# EAGLE design GFB_MCU_Testboard (EAGLE 9.6.2)
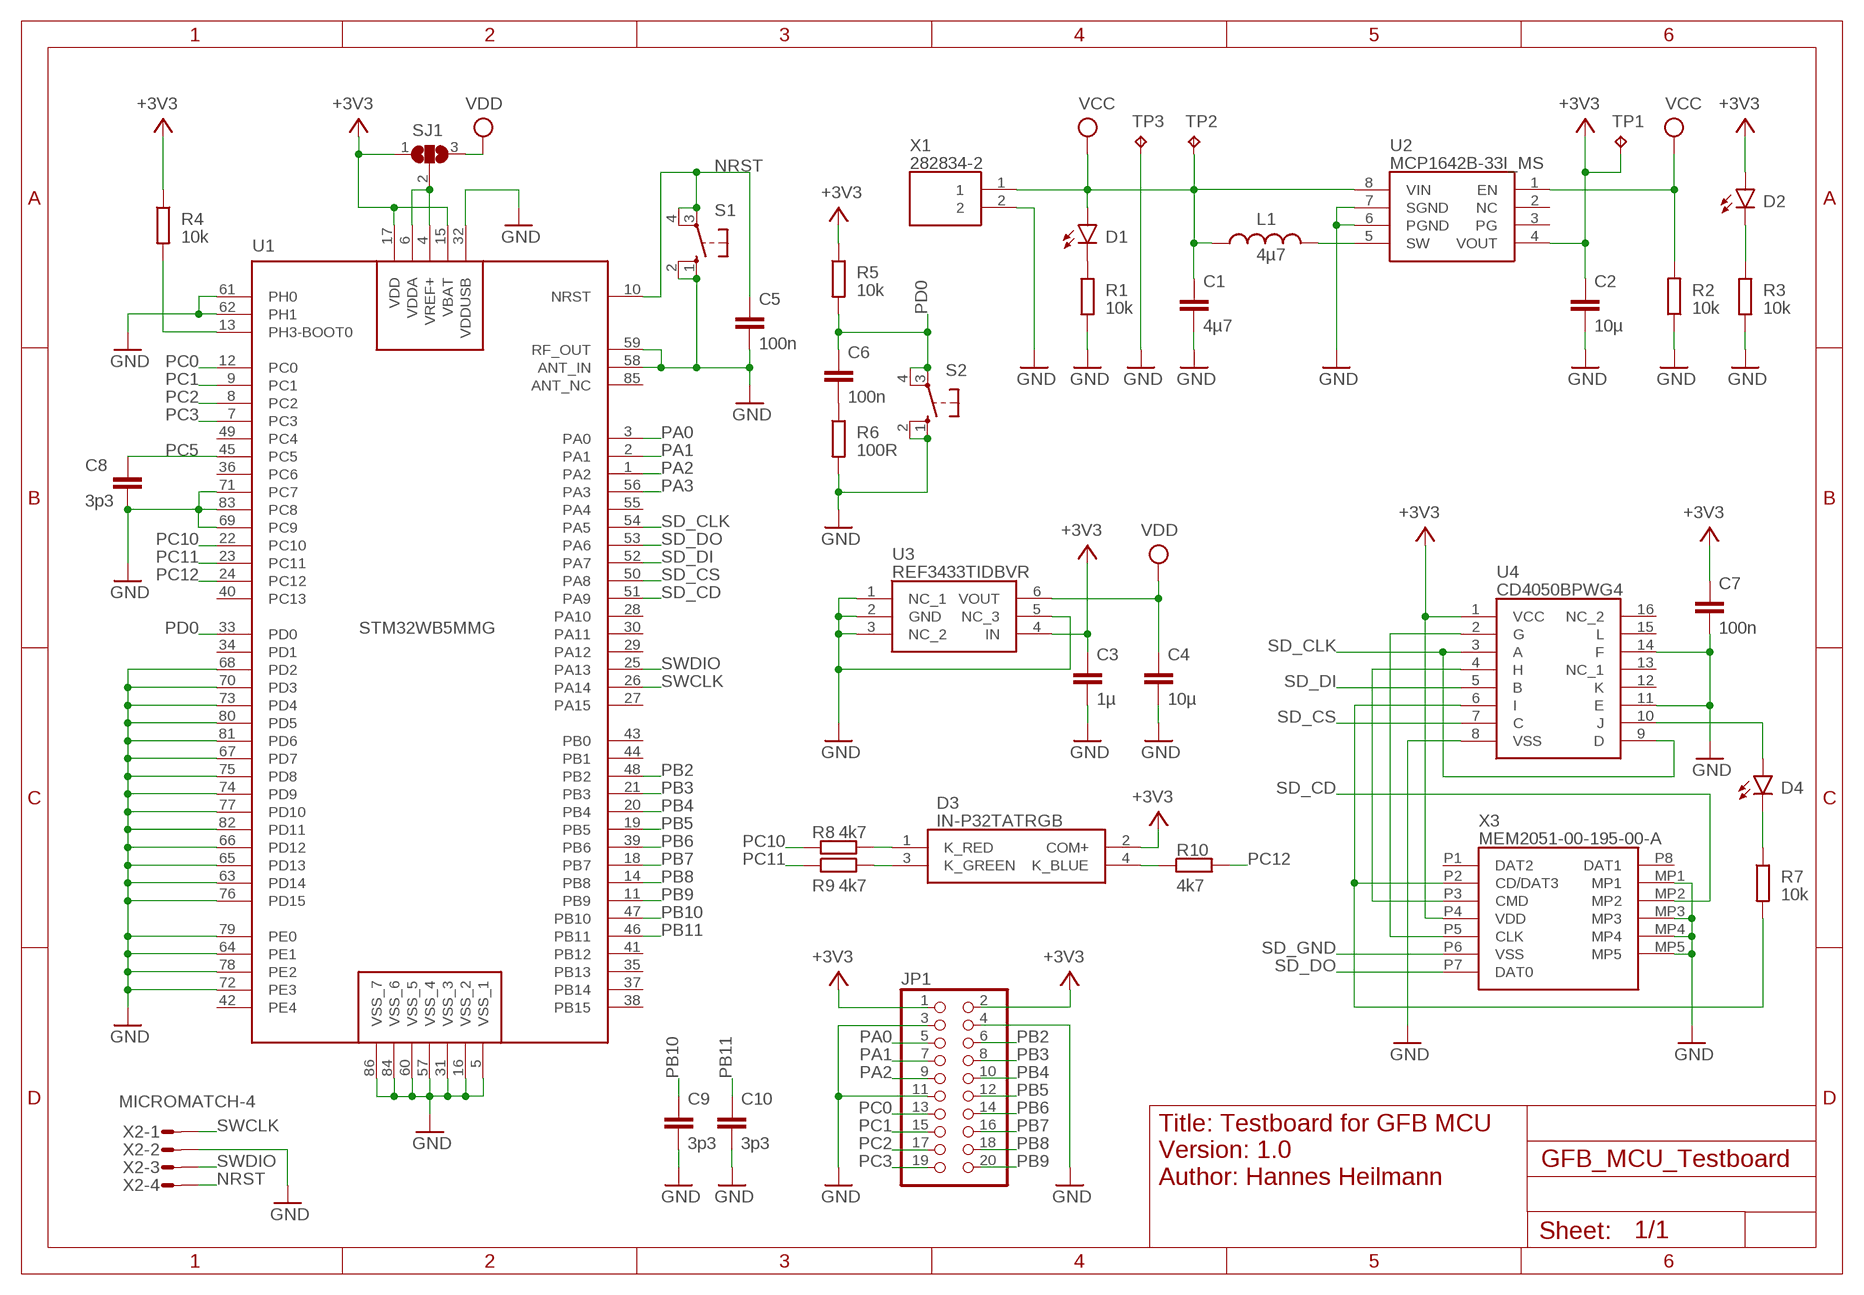
[diagram p0: schematic, sheet 1]

## Parts
C1  4µ7  C-EUC1206K  [C1206K]
C2  10µ  C-EUC1206K  [C1206K]
C3  1µ  C-EUC1206K  [C1206K]
C4  10µ  C-EUC1206K  [C1206K]
C5  100n  C-EUC0805K  [C0805K]
C6  100n  C-EUC0805K  [C0805K]
C7  100n  C-EUC0805K  [C0805K]
C8  3p3  C-EUC0805K  [C0805K]
C9  3p3  C-EUC0805K  [C0805K]
C10  3p3  C-EUC0805K  [C0805K]
D1  LEDSML0805  [SML0805]
D2  LEDSML0805  [SML0805]
D3  IN-P32TATRGB  [INP32TATRGB]
D4  LEDSML0805  [SML0805]
JP1  PINHD-2X10  [2X10]
L1  4µ7  L-USL4532P  [L4532P]
R1  10k  R-EU_R0805  [R0805]
R2  10k  R-EU_R0805  [R0805]
R3  10k  R-EU_R0805  [R0805]
R4  10k  R-EU_R0805  [R0805]
R5  10k  R-EU_R0805  [R0805]
R6  100R  R-EU_R0805  [R0805]
R7  10k  R-EU_R0805  [R0805]
R8  4k7  R-EU_R0805  [R0805]
R9  4k7  R-EU_R0805  [R0805]
R10  4k7  R-EU_R0805  [R0805]
S1  10-XX  [B3F-10XX]
S2  10-XX  [B3F-10XX]
SJ1  SJ2W  [SJ_2]
TP1  TPB2,54  [B2,54]
TP2  TPB2,54  [B2,54]
TP3  TPB2,54  [B2,54]
U1  STM32WB5MMG  [STM32WB5MMG]
U2  MCP1642B-33I_MS  [SOP65P490X110-8N]
U3  REF3433TIDBVR  [SOT95P280X145-6N]
U4  CD4050BPWG4  [SOP65P640X120-16N]
X1  282834-2  [282834-2_1]
X2  MICROMATCH-4  [MICROMATCH-4]
X3  MEM2051-00-195-00-A  [MEM20510019500A]

## Nets
+3V3: C2.1 C3.1 C7.1 D2.A D3.2(COM+) JP1.1 JP1.2 R4.1 R5.1 SJ1.1 TP1.TP U1.15(VBAT) U1.17(VDD) U2.4(VOUT) U3.4(IN) U4.1(VCC) X3.P4(VDD)
GND: C1.2 C2.2 C3.2 C4.2 C5.2 C7.2 C8.2 C9.2 C10.2 JP1.3 JP1.4 JP1.11 R1.2 R2.1 R3.2 R6.2 S1.1(S) S1.2(S1) S2.1(S) S2.2(S1) TP3.TP U1.5(VSS_1) U1.16(VSS_2) U1.31(VSS_3) U1.32(VDDUSB) U1.57(VSS_4) U1.58(ANT_IN) U1.59(RF_OUT) U1.60(VSS_5) U1.61(PH0) U1.62(PH1) U1.63(PD14) U1.64(PE1) U1.65(PD13) U1.66(PD12) U1.67(PD7) U1.68(PD2) U1.69(PC9) U1.70(PD3) U1.71(PC7) U1.72(PE3) U1.73(PD4) U1.74(PD9) U1.75(PD8) U1.76(PD15) U1.77(PD10) U1.78(PE2) U1.79(PE0) U1.80(PD5) U1.81(PD6) U1.82(PD11) U1.83(PC8) U1.84(VSS_6) U1.86(VSS_7) U2.6(PGND) U2.7(SGND) U3.1(NC_1) U3.2(GND) U3.3(NC_2) U3.5(NC_3) U4.8(VSS) U4.11(E) U4.14(F) X1.2 X2.2 X3.MP1 X3.MP3 X3.MP4 X3.MP5
N$1: D2.C R3.1
N$2: L1.2 U2.5(SW)
N$3: D1.C R1.1
N$4: R4.2 U1.13(PH3-BOOT0)
N$5: C6.2 R6.1
N$6: U4.2(G) X3.P5(CLK)
N$7: SJ1.2 U1.4(VREF+) U1.6(VDDA)
N$8: D3.3(K_GREEN) R9.2
N$9: D3.1(K_RED) R8.2
N$10: D3.4(K_BLUE) R10.1
N$14: D4.C R7.1
N$15: R7.2 U4.6(I) X3.P2(CD/DAT3)
N$16: U4.4(H) X3.P3(CMD)
N$17: D4.A U4.10(J)
NRST: C5.1 S1.3(P) S1.4(P1) U1.10(NRST) X2.4
PA0: JP1.5 U1.3(PA0)
PA1: JP1.7 U1.2(PA1)
PA2: JP1.9 U1.1(PA2)
PA3: U1.56(PA3)
PB2: JP1.6 U1.48(PB2)
PB3: JP1.8 U1.21(PB3)
PB4: JP1.10 U1.20(PB4)
PB5: JP1.12 U1.19(PB5)
PB6: JP1.14 U1.39(PB6)
PB7: JP1.16 U1.18(PB7)
PB8: JP1.18 U1.14(PB8)
PB9: JP1.20 U1.11(PB9)
PB10: C9.1 U1.47(PB10)
PB11: C10.1 U1.46(PB11)
PC0: JP1.13 U1.12(PC0)
PC1: JP1.15 U1.9(PC1)
PC2: JP1.17 U1.8(PC2)
PC3: JP1.19 U1.7(PC3)
PC5: C8.1 U1.45(PC5)
PC10: R8.1 U1.22(PC10)
PC11: R9.1 U1.23(PC11)
PC12: R10.2 U1.24(PC12)
PD0: C6.1 R5.2 S2.3(P) S2.4(P1) U1.33(PD0)
SD_CD: U1.51(PA9) X3.MP2
SD_CLK: U1.54(PA5) U4.3(A) U4.9(D)
SD_CS: U1.50(PA8) U4.7(C)
SD_DI: U1.52(PA7) U4.5(B)
SD_DO: U1.53(PA6) X3.P7(DAT0)
SD_GND: X3.P6(VSS)
SWCLK: U1.26(PA14) X2.1
SWDIO: U1.25(PA13) X2.3
VCC: C1.1 D1.A L1.1 R2.2 TP2.TP U2.1(EN) U2.8(VIN) X1.1
VDD: C4.1 SJ1.3 U3.6(VOUT)
Unconnected: U1.27(PA15) U1.28(PA10) U1.29(PA12) U1.30(PA11) U1.34(PD1) U1.35(PB13) U1.36(PC6) U1.37(PB14) U1.38(PB15) U1.40(PC13) U1.41(PB12) U1.42(PE4) U1.43(PB0) U1.44(PB1) U1.49(PC4) U1.55(PA4) U1.85(ANT_NC) U2.2(NC) U2.3(PG) U4.12(K) U4.13(NC_1) U4.15(L) U4.16(NC_2) X3.P1(DAT2) X3.P8(DAT1)

## Notes on the sheet
- U1
- Title: Testboard for GFB MCU
  Version: 1.0
  Author: Hannes Heilmann

## Library data of the parts
C1-C10 = rcl:C-EU: CAPACITOR, European symbol; SPICEPREFIX: C
D1 D2 D4 = led:LED: LED OSRAM: - CHIPLED LG R971, LG N971, LY N971, LG Q971, LY Q971, LO R971, LY R971 LH N974, LH R974 LS Q976, LO Q976, LY Q976 LO Q996 - Hyper CHIPLED LW Q18S LB Q993, LB Q99A, LB R99A - SideLED LS A670, LO A670, LY A670, LG A670, LP A670 LB A673, LV A673, LT A673, LW A673 LH A674 LY A675 LS A676, LA A676, LO A676, LY A676, LW A676 LS A679, LY A679, LG A679 - Hyper Micro SIDELED® LS Y876, LA Y876, LO Y876, LY Y876 LT Y87S - SmartLED LW L88C, LW L88S LB L89C, LB L89S, LG L890 LS L89K, LO L89K, LY L89K LS L896, LA L896, LO L896, LY L896 - TOPLED LS T670, LO T670, LY T670, LG T670, LP T670 LSG T670, LSP T670, LSY T670, LOP T670, LYG T670 LG T671, LOG T671, LSG T671 LB T673, LV T673, LT T673, LW T673 LH T674 LS T676, LA T676, LO T676, LY T676, LB T676, LH T676, LSB T676, LW T676 LB T67C, LV T67C, LT T67C, LS T67K, LO T67K, LY T67K, LW E67C LS E67B, LA E67B, LO E67B, LY E67B, LB E67C, LV E67C, LT E67C LW T67C LS T679, LY T679, LG T679 LS T770, LO T770, LY T770, LG T770, LP T770 LB T773, LV T773, LT T773, LW T773 LH T774 LS E675, LA E675, LY E675, LS T675 LS T776, LA T776, LO T776, LY T776, LB T776 LHGB T686 LT T68C, LB T68C - Hyper Mini TOPLED® LB M676 - Mini TOPLED Santana® LG M470 LS M47K, LO M47K, LY M47K Source: http://www.osram.convergy.de LUXEON: - LUMILED® LXK2-PW12-R00, LXK2-PW12-S00, LXK2-PW14-U00, LXK2-PW14-V00 LXK2-PM12-R00, LXK2-PM12-S00, LXK2-PM14-U00 LXK2-PE12-Q00, LXK2-PE12-R00, LXK2-PE12-S00, LXK2-PE14-T00, LXK2-PE14-U00 LXK2-PB12-K00, LXK2-PB12-L00, LXK2-PB12-M00, LXK2-PB14-N00, LXK2-PB14-P00, LXK2-PB14-Q00 LXK2-PR12-L00, LXK2-PR12-M00, LXK2-PR14-Q00, LXK2-PR14-R00 LXK2-PD12-Q00, LXK2-PD12-R00, LXK2-PD12-S00 LXK2-PH12-R00, LXK2-PH12-S00 LXK2-PL12-P00, LXK2-PL12-Q00, LXK2-PL12-R00 Source: www.luxeon.com KINGBRIGHT: KA-3528ASYC Source: www.kingbright.com
D3 = SamacSys_Parts:IN-P32TATRGB: Standard LEDs - SMD RGB LED Source: Datasheet <http://www.inolux-corp.com/datasheet/SMDLED/RGB Top View/IN-P32TATRGB_V1.0.pdf>; ARROW_PART_NUMBER: IN-P32TATRGB; ARROW_PRICE-STOCK: https://www.arrow.com/en/products/in-p32tatrgb/inolux-corporation?region=nac; DESCRIPTION: Standard LEDs - SMD RGB LED; HEIGHT: 1.9mm; MANUFACTURER_NAME: Inolux; MANUFACTURER_PART_NUMBER: IN-P32TATRGB; MOUSER_PART_NUMBER: 743-IN-P32TATRGB; MOUSER_PRICE-STOCK: https://www.mouser.co.uk/ProductDetail/Inolux/IN-P32TATRGB?qs=fAHHVMwC%252BbjKmGK7RdhY0g%3D%3D
JP1 = pinhead:PINHD-2X10: PIN HEADER
L1 = rcl:L-US: INDUCTOR, American symbol; SPICEPREFIX: L
R1-R10 = rcl:R-EU_: RESISTOR, European symbol; SPICEPREFIX: R
S1 S2 = switch-omron:10-XX: OMRON SWITCH; MPN: B3F-1000; OC_FARNELL: 176432; OC_NEWARK: 36M3542
SJ1 = jumper:SJ2W: SMD solder JUMPER
TP1-TP3 = testpad:TP: Test pad
U1 = GFB_Sensorsystem:STM32WB5MMG
U2 = SamacSys_Parts:MCP1642B-33I_MS: Conv DC-DC 0.5V to 5.5V Synchronous Step Up Single-Out 3.3V 0.3A 8-Pin MSOP Tube Source: Datasheet <https://ww1.microchip.com/downloads/en/DeviceDoc/20005253A.pdf>; ARROW_PART_NUMBER: MCP1642B-33I/MS; ARROW_PRICE-STOCK: https://www.arrow.com/en/products/mcp1642b-33ims/microchip-technology?region=nac; DESCRIPTION: Conv DC-DC 0.5V to 5.5V Synchronous Step Up Single-Out 3.3V 0.3A 8-Pin MSOP Tube; HEIGHT: 1.1mm; MANUFACTURER_NAME: Microchip; MANUFACTURER_PART_NUMBER: MCP1642B-33I/MS; MOUSER_PART_NUMBER: 579-MCP1642B-33I/MS; MOUSER_PRICE-STOCK: https://www.mouser.co.uk/ProductDetail/Microchip-Technology/MCP1642B-33I-MS?qs=kUzwwg2uGjUwNcbFIRVB%252Bw%3D%3D
U3 = SamacSys_Parts:REF3433TIDBVR: Voltage References 3.3-V, low-drift, low-power, small-footprint series voltage reference Source: Datasheet <https://www.ti.com/lit/gpn/ref3433>; DESCRIPTION: Voltage References 3.3-V, low-drift, low-power, small-footprint series voltage reference; HEIGHT: 1.45mm; MANUFACTURER_NAME: Texas Instruments; MANUFACTURER_PART_NUMBER: REF3433TIDBVR; MOUSER_PART_NUMBER: 595-REF3433TIDBVR; MOUSER_PRICE-STOCK: https://www.mouser.co.uk/ProductDetail/Texas-Instruments/REF3433TIDBVR?qs=pBJMDPsKWf2r5TelmTr7fg%3D%3D
U4 = SamacSys_Parts:CD4050BPWG4: IC BUFF/CONVERTER HEX 16TSSOP Source: Datasheet <http://www.ti.com/lit/ds/symlink/cd4049ub.pdf>; DESCRIPTION: IC BUFF/CONVERTER HEX 16TSSOP; HEIGHT: 1.2mm; MANUFACTURER_NAME: Texas Instruments; MANUFACTURER_PART_NUMBER: CD4050BPWG4
X1 = SamacSys_Parts:282834-2: TE Connectivity, Buchanan 2.54mm Pitch, 2 Way PCB Terminal Strip Source: Datasheet <https://www.te.com/commerce/DocumentDelivery/DDEController?Action=srchrtrv&DocNm=1-1773458-1_EURO_STYLE_QRG&DocType=Data Sheet&DocLang=English&PartCntxt=282834-2&DocFormat=pdf>; ARROW_PART_NUMBER: 282834-2; ARROW_PRICE-STOCK: https://www.arrow.com/en/products/282834-2/te-connectivity?region=europe; DESCRIPTION: TE Connectivity, Buchanan 2.54mm Pitch, 2 Way PCB Terminal Strip; HEIGHT: mm; MANUFACTURER_NAME: TE Connectivity; MANUFACTURER_PART_NUMBER: 282834-2; MOUSER_PART_NUMBER: 571-282834-2; MOUSER_PRICE-STOCK: https://www.mouser.co.uk/ProductDetail/TE-Connectivity/282834-2?qs=A%252Bip%252BNCYi6N8cVKuk8xDog%3D%3D
X2 = con-amp-micromatch:MICROMATCH-4: MicroMaTch 4 7-215464-4 / 0-215464-4 Drawing Number C-215464 DDEController.pdf; MPN: 7-215464-4; OC_FARNELL: 3784629; OC_NEWARK: 19R8124
X3 = SamacSys_Parts:MEM2051-00-195-00-A: MICRO SD PUSH PUSH, OPEN, SMT, 1 Source: Datasheet <https://gct.co/files/drawings/mem2051.pdf>; DESCRIPTION: MICRO SD PUSH PUSH, OPEN, SMT, 1; HEIGHT: 2.05mm; MANUFACTURER_NAME: GCT (GLOBAL CONNECTOR TECHNOLOGY); MANUFACTURER_PART_NUMBER: MEM2051-00-195-00-A; MOUSER_PART_NUMBER: 640-MEM20510019500A; MOUSER_PRICE-STOCK: https://www.mouser.co.uk/ProductDetail/GCT/MEM2051-00-195-00-A?qs=KUoIvG%2F9Ilat7yfJRNWXUQ%3D%3D

## Board
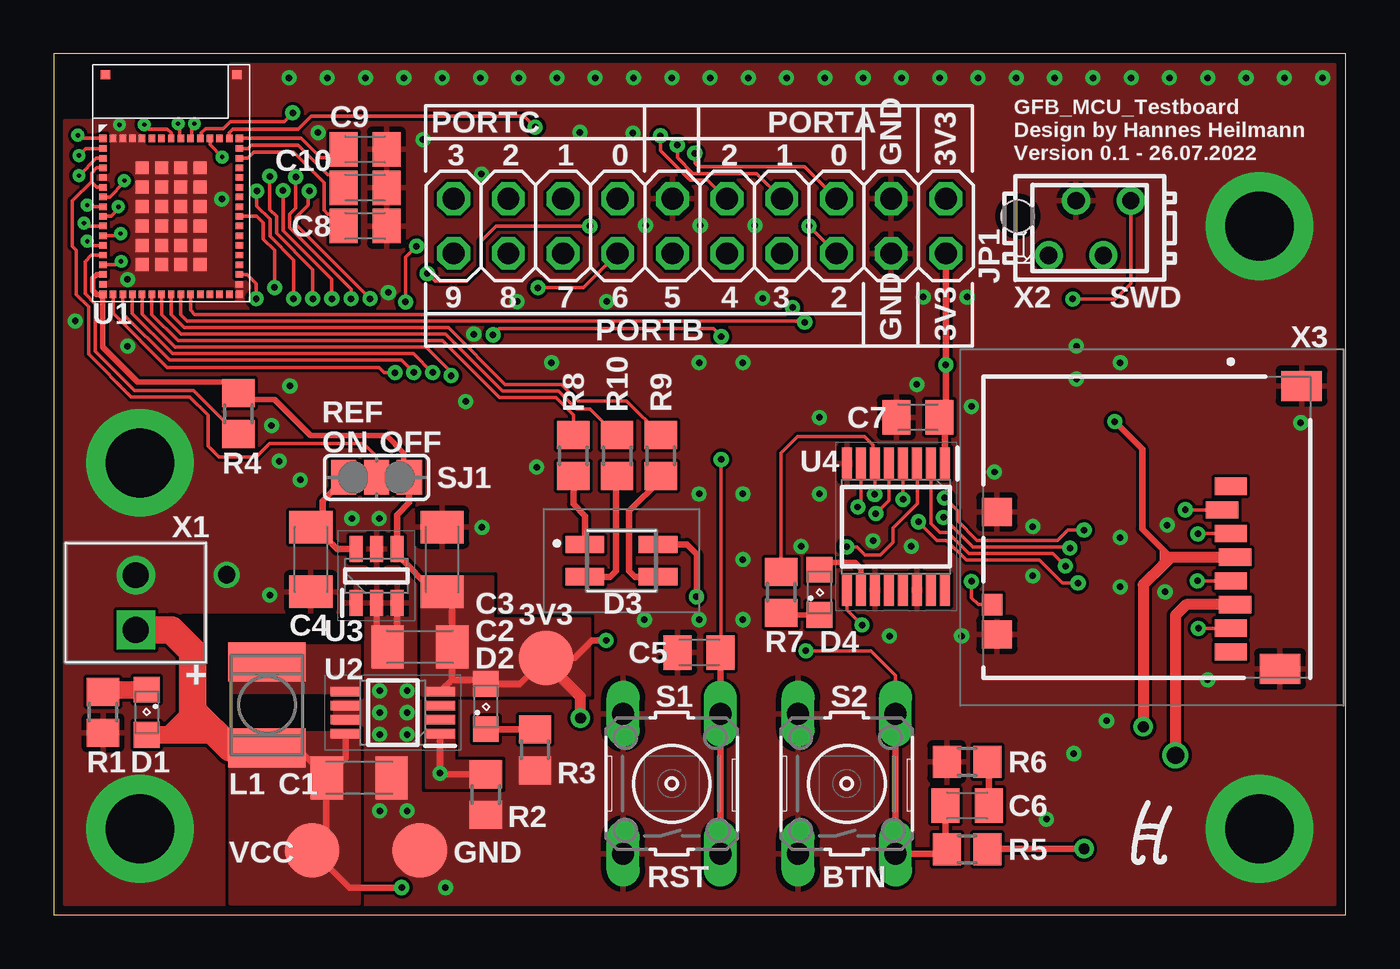
[diagram p1: board, top side]
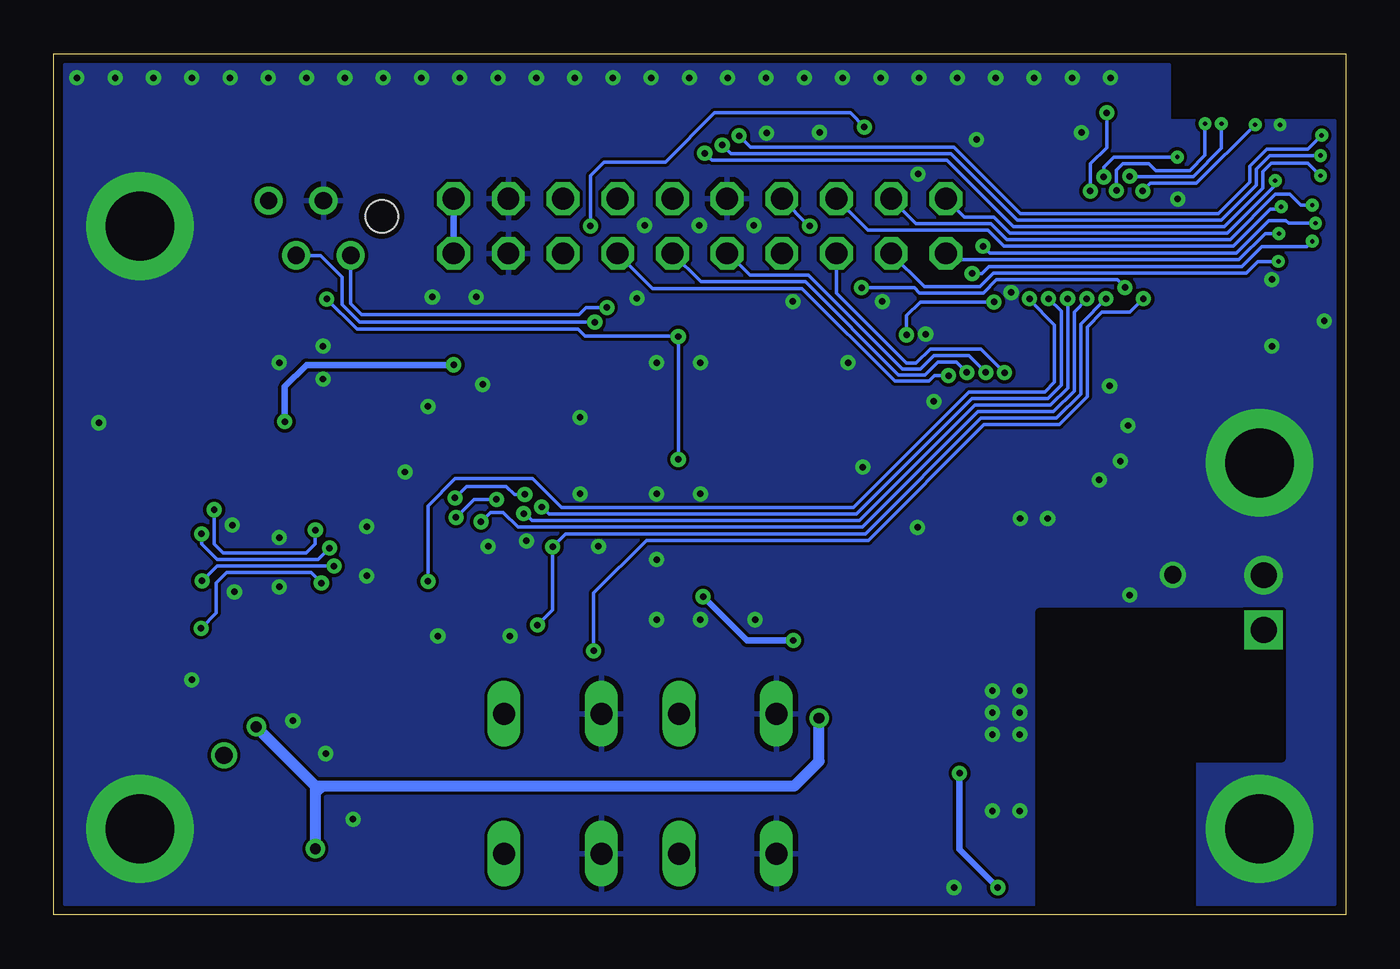
[diagram p2: board, bottom side, seen from below]

Size 60 x 40 mm. Coordinates in mm from the lower left corner, seen from the top.
Outline: 0,0 60,0 60,40 0,40 0,0
Copper layers (1*16): Top 0.035mm / dielectric 1.5mm / Bottom 0.035mm
Design rules "default *": minimum track width 0.125mm, minimum drill 0.2mm, track to track 0.125mm, track to pad 0.125mm, pad to pad 0.125mm, via to via 0.125mm, smd to smd 0.125mm, copper to edge 0.3mm, drill to drill 0.25mm, minimum pad ring 10mil, minimum via ring 0.2mm, stop-mask expansion 1mil, vias tented up to drill 0mil, thermal gap 10mil
tRestrict: area 6,8.8 to 14.2,13.8
bRestrict: area 7.2,0.5 to 14.2,14; area 3,7.3 to 7.2,14

### Footprints (pad centres in the part's own frame; a part is rotated, then mirrored left to right if it is on the bottom)
C1206K = smd 1.5 x 2: 1 -1.5,0; 2 1.5,0
C0805K = smd 1.3 x 1.6: 1 -1,0; 2 1,0
SML0805 = smd 1.2 x 1.2: A 1.05,0; C -1.05,0
INP32TATRGB = smd 1.8 x 0.8: 1 -1.7,0.75; 2 1.7,0.75; 3 -1.7,-0.75; 4 1.7,-0.75
2X10 = drill 1.016 octagon: 1 -11.43,-1.27; 2 -11.43,1.27; 3 -8.89,-1.27; 4 -8.89,1.27; 5 -6.35,-1.27; 6 -6.35,1.27; 7 -3.81,-1.27; 8 -3.81,1.27; 9 -1.27,-1.27; 10 -1.27,1.27; 11 1.27,-1.27; 12 1.27,1.27; 13 3.81,-1.27; 14 3.81,1.27; 15 6.35,-1.27; 16 6.35,1.27; 17 8.89,-1.27; 18 8.89,1.27; 19 11.43,-1.27; 20 11.43,1.27
L4532P = smd 1.8 x 3.6: 1 -2,0; 2 2,0
R0805 = smd 1.3 x 1.5: 1 -0.95,0; 2 0.95,0
B3F-10XX = drill 1.016 long: 1 -3.251,2.261; 2 3.251,2.261; 3 -3.251,-2.261; 4 3.251,-2.261
SJ_2 = smd 1.168 x 1.6: 1 -1.524,0; 2 0,0; 3 1.524,0
B2,54 = smd 2.54 x 2.54: TP 0,0
STM32WB5MMG = smd 0.35 x 0.35: 1 0.475,7.575; 17 0.475,0.325; 31 6.825,0.325; 47 6.825,7.575 | smd 0.35 x 0.3: 2 0.476,7.1; 3 0.475,6.65; 4 0.475,6.2; 5 0.475,5.75; 6 0.475,5.3; 7 0.475,4.85; 8 0.475,4.4; 9 0.475,3.95; 10 0.475,3.5; 11 0.475,3.05; 12 0.475,2.6; 13 0.475,2.15; 14 0.475,1.7; 15 0.475,1.25; 16 0.475,0.8; 32 6.825,0.8; 33 6.825,1.25; 34 6.825,1.7; 35 6.825,2.15; 36 6.825,2.6; 37 6.825,3.05; 38 6.825,3.5; 39 6.825,3.95; 40 6.825,4.4; 41 6.825,4.85; 42 6.825,5.3; 43 6.825,5.75; 44 6.825,6.2; 45 6.825,6.65; 46 6.825,7.1 | smd 0.3 x 0.35: 18 0.95,0.325; 19 1.4,0.325; 20 1.85,0.325; 21 2.3,0.325; 22 2.75,0.325; 23 3.2,0.325; 24 3.65,0.325; 25 4.1,0.325; 26 4.55,0.325; 27 5,0.325; 28 5.45,0.325; 29 5.9,0.325; 30 6.35,0.325; 48 6.35,7.575; 49 5.9,7.575; 50 5.45,7.575; 51 5,7.575; 52 4.55,7.575; 53 4.1,7.575; 54 3.65,7.575; 55 3.2,7.575; 56 2.75,7.575; 57 2.3,7.575; 58 1.85,7.575; 59 1.4,7.575; 60 0.95,7.575 | smd 0.6 x 0.6: 61 2.3,6.2; 62 2.3,5.3; 63 2.3,4.4; 64 2.3,3.5; 65 2.3,2.6; 66 2.3,1.7; 67 3.2,1.7; 68 4.1,1.7; 69 5,1.7; 70 5,2.6; 71 5,3.5; 72 5,4.4; 73 5,5.3; 74 5,6.2; 75 4.1,6.2; 76 3.2,6.2; 77 3.2,5.3; 78 3.2,4.4; 79 3.2,3.5; 80 3.2,2.6; 81 4.1,2.6; 82 4.1,3.5; 83 4.1,4.4; 84 4.1,5.3 | smd 0.43 x 0.43: 85 0.6,10.535; 86 6.7,10.535
SOP65P490X110-8N = smd 1.4 x 0.45: 1 -2.2,0.975; 2 -2.2,0.325; 3 -2.2,-0.325; 4 -2.2,-0.975; 5 2.2,-0.975; 6 2.2,-0.325; 7 2.2,0.325; 8 2.2,0.975
SOT95P280X145-6N = smd 1.2 x 0.6: 1 -1.25,0.95; 2 -1.25,0; 3 -1.25,-0.95; 4 1.25,-0.95; 5 1.25,0; 6 1.25,0.95
SOP65P640X120-16N = smd 1.475 x 0.45: 1 -2.938,2.275; 2 -2.938,1.625; 3 -2.938,0.975; 4 -2.938,0.325; 5 -2.938,-0.325; 6 -2.938,-0.975; 7 -2.938,-1.625; 8 -2.938,-2.275; 9 2.938,-2.275; 10 2.938,-1.625; 11 2.938,-0.975; 12 2.938,-0.325; 13 2.938,0.325; 14 2.938,0.975; 15 2.938,1.625; 16 2.938,2.275
282834-2_1 = drill 1.2 pad 1.8 square: 1 0,0 | drill 1.2 pad 1.8: 2 2.54,0
MICROMATCH-4 = drill 0.8: 1 1.905,1.27; 2 0.635,-1.27; 3 -0.635,1.27; 4 -1.905,-1.27 | hole 1.5: 3.34,-0.55
MEM20510019500A = smd 1.3 x 1.4: MP1 -4.975,7.199; MP3 0.725,7.199 | smd 1 x 0.95: MP2 -3.585,7.425 | smd 1.4 x 1.9: MP4 -6.575,-5.95; MP5 6.575,-6.95 | smd 0.8 x 1.5: P1 1.915,-3.661; P2 0.815,-3.261; P3 -0.285,-3.661; P4 -1.385,-3.861; P5 -2.485,-3.661; P6 -3.585,-3.861; P7 -4.685,-3.661; P8 -5.785,-3.661

### Placement (x,y rotation side)
C1  14.19,6.38 0 top
C2  17,12.45 180 top
C3  18.03,16.51 90 top
C4  11.94,16.51 270 top
C5  29.97,12.19 180 top
C6  42.42,5.08 0 top
C7  40.13,23.11 180 top
C8  14.46,32 0 top
C9  14.46,35.56 0 top
C10  14.46,33.78 0 top
D1  4.32,9.41 270 top
D2  20.07,9.68 90 top
D3  26.37,16.46 0 top
D4  35.56,14.99 90 top
JP1  30,32 180 top
L1  9.91,9.75 90 top
R1  2.29,9.41 270 top
R2  20.07,5.59 90 top
R3  22.35,7.67 270 top
R4  8.57,23.28 270 top
R5  42.42,3.05 180 top
R6  42.42,7.11 180 top
R7  33.78,14.99 90 top
R8  24.13,21.34 270 top
R9  26.16,21.34 270 top
R10  28.19,21.34 90 top
S1  28.7,6.1 90 top
S2  36.83,6.1 90 top
SJ1  14.99,20.32 180 top
TP1  22.86,11.94 0 top
TP2  12,3 0 top
TP3  17,3 0 top
U1  1.8,28.5 0 top
U2  15.75,9.4 180 top
U3  14.99,15.75 90 top
U4  39.12,18.03 270 top
X1  3.81,13.24 90 top
X2  48.11,31.91 180 top
X3  51,18 90 top

### Tracks (layer width: path | path; a pad name or v marks a point on that pad's centre or on a via)
+3V3  (via drill 0.3 pad 0.7, 0.5 pad 0.9)
  Top 0.254: SJ1.1 16.26,20.57 16.26,21.46 15.46,22.26 11.93,22.26 10.26,23.93 8.87,23.93 R4.1 8.05,24.75 3.9,24.75 2.27,26.38 U1.17 2,28.82 1.82,29.01 1.82,29.58 1.99,29.75 U1.15
  Top 0.305: SJ1.1 16.51,19.15 15.94,18.58 U3.4 15.94,16.74 17.67,15.01 C3.1 18.5,14.54 C2.1 18.5,10.93 | U4.1 41.39,22.86 C7.1 41.43,23.41 v41.43,25.55 JP1.2 | v47.85,3.07 43.39,3.07 R5.1 | D3.2 29.4,17.21 29.87,16.74 29.87,14.81 v29.84,14.78 | v25.65,12.75 24.99,12.75 24.18,11.94 TP1.TP 21.65,10.73 D2.A 19.87,10.93 18.5,10.93 | U2.4 18.5,10.93 | 51.87,16.61 51.5,16.99 | 51.5,16.99 50.55,17.94 50.55,21.64 v49.28,22.91 | 51.5,16.24 51.5,16.99
  Top 0.508: v24.46,9.14 24.46,10.13 22.86,11.73 TP1.TP | X3.P4 51.87,16.61 51.5,16.24 50.6,15.34 v50.6,8.74
  Bottom 0.305: JP1.2 JP1.1 | v49.28,22.91 49.28,24.54 48.26,25.55 v41.43,25.55 | v29.84,14.78 27.81,12.75 v25.65,12.75
  Bottom 0.508: v50.6,8.74 47.85,5.99 | 47.85,5.99 47.85,5.66 | 47.85,5.66 v47.85,3.07 | 47.85,5.99 47.52,5.99 | 47.52,5.99 25.6,5.99 24.46,7.14 v24.46,9.14 | 47.52,5.99 47.85,5.66
  pour Top (isolate 0.15, no thermals): 17.09,14.45 17.09,10.21 19.02,10.21 24.89,10.21 24.89,13.74 20.37,13.74 20.37,15.57 20.37,15.7 17.65,15.7 17.09,15.7
GND  (via drill 0.2 pad 0.6, 0.3 pad 0.7, 0.8 pad 1.2, 3.2 pad 5)
  Top 0.305: U3.2 14.99,12.45 C2.2 15.94,12.88 U3.3
  other vias: 3.43,29.51 15.54,28.91 7.8,33.25 12.27,36.34 19.51,26.97 21.52,28.5 10.96,24.57 3.43,26.42 23.11,25.65 25.68,28.5 32.92,28.65 40.39,28.7 32,25.65 17.14,36.02 24.43,36.35 26.9,36.32 15.14,8.38 16.41,8.38 16.41,9.4 16.41,10.41 15.14,10.41 15.14,9.4 15.14,4.83 16.41,4.83 18.19,1.27 27.48,32.03 30.02,32.03 32.56,32.03 19.86,34.42 15.11,18.41 13.84,18.41 19.89,18.01 27.43,13.72 32,19.56 29.97,19.56 29.97,25.65 42.42,28.7 10.92,38.89 12.7,38.89 14.48,38.89 16.26,38.89 18.03,38.89 19.81,38.89 21.59,38.89 23.37,38.89 25.15,38.89 26.92,38.89 28.7,38.89 30.48,38.89 32.26,38.89 34.04,38.89 35.81,38.89 37.59,38.89 39.37,38.89 41.15,38.89 42.93,38.89 44.7,38.89 46.48,38.89 48.26,38.89 50.04,38.89 51.82,38.89 53.59,38.89 55.37,38.89 57.15,38.89 58.93,38.89 10.03,14.86 10.11,22.73 11.45,20.21 22.43,20.8 46.1,4.45 47.37,7.49 48.9,9.02 19.13,23.85 34.71,17.12 38.05,17.37 32,16.51 38.81,12.95 42.62,23.62 40.08,24.64 47.5,24.89 47.5,26.42 49.53,25.65 35.56,19.56 0.99,27.59 29.97,13.72 32,13.72 10.46,21.08 35.56,23.11 51.61,15.01 51.71,18.11 49.53,17.53 49.53,15.24 53.59,10.92 42.16,12.95 43.69,20.57 39.82,17.12 45.47,18.03 45.47,15.75 57.91,22.86 4,21 4,4 56,4 56,32 3.05,36.7 8.03,15.8
  pour Top (isolate 0.15, rank 2): 0.5,0.5 59.5,0.5 59.5,39.5 8.2,39.5 8.2,36.9 0.5,36.9
  pour Top (isolate 0.15, no thermals): 1.8,36.5 1.8,28.02 9.1,28.02 9.1,36.5
  pour Top (isolate 0.15, no thermals): 8.9,38.7 8.9,39.5 8.2,39.5 8.2,38.6 8.9,38.6
  pour Bottom (isolate 0.15, rank 2): 0.5,0.5 59.5,0.5 59.5,39.5 8.2,39.5 8.2,36.9 0.5,36.9
  pour Top (no thermals): 2.31,14.58 5.21,14.58 5.21,17.22 2.31,17.22
  pour Bottom (no thermals): 2.44,14.5 5.23,14.5 5.23,17.07 2.44,17.07
  pour Top (isolate 0.15, rank 2, no thermals): 6.88,0.53 24.03,0.53 24.03,13.77 6.88,13.77
N$1
  Top 0.305: D2.C R3.1
N$2
  pour Top (isolate 0.15, no thermals): 14.17,10.24 8.18,10.24 8.18,12.6 14.17,12.6
N$3
  Top 0.813: D1.C 2.39,10.46 R1.1
N$4
  Top 0.152: U1.13 1.75,30.65 1.45,30.35 1.45,28.85 1.92,28.38 1.92,26.2 3.76,24.36 6.49,24.36 8.51,22.33 R4.2
N$5
  Top 0.305: C6.2 43.42,7.06 R6.1
N$6  (via drill 0.3 pad 0.7)
  Top 0.152: U4.2 40.74,18.18 41.15,17.77 41.53,17.77 42.51,16.79 46.41,16.79 v46.99,16.21 | X3.P5 v53.12,15.52 v53.11,15.52
  Bottom 0.152: v53.11,15.52 52.42,16.21 v46.99,16.21
N$7
  Top 0.152: U1.6 1.99,33.8 1.75,34.04 1.75,34.06 | 1.75,34.06 1.75,34.47 1.99,34.7 U1.4 | 1.75,34.06 0.87,33.17 0.87,31.06 1.04,30.88 1.04,28.82 1.62,28.25 1.62,26.05 3.6,24.07 6.32,24.07 7.16,23.22 7.16,21.78 7.67,21.27 9.4,21.27 10.03,21.9 14.39,21.9 14.99,21.3 SJ1.2
N$8
  Top 0.305: 26.11,20.34 26.11,15.98 25.84,15.71 D3.3
  Top 0.406: 26.11,20.34 R9.2
N$9
  Top 0.305: D3.1 24.66,18.54 24.13,19.08 R8.2
N$10
  Top 0.305: R10.1 28.19,20.23 26.72,18.76 26.72,15.98 26.99,15.71 D3.4
N$14
  Top 0.254: D4.C 33.88,13.94 R7.1
N$15  (via drill 0.3 pad 0.7)
  Top 0.152: R7.2 33.78,21.46 34.54,22.23 37.65,22.23 38.04,21.83 38.04,21.07 U4.6 38.14,19.55 v38.12,19.53 | v41.37,19.37 41.96,18.78 41.96,18.32 42.88,17.4 46.62,17.4 47.1,17.88 v47.85,17.88 | X3.P2 v52.56,18.82 v52.55,18.82
  Bottom 0.152: v41.37,19.37 40.83,19.91 38.99,19.91 38.61,19.53 v38.12,19.53 | v52.55,18.82 52.55,17.22 52.14,16.81 48.28,16.81 47.85,17.24 v47.85,17.88
N$16  (via drill 0.3 pad 0.7)
  Top 0.152: v41.33,18.46 42.7,17.09 47.14,17.09 v47.19,17.04 | v39.45,19.3 v39.44,19.31 U4.4 | X3.P3 53.15,17.71 v53.14,17.7
  Bottom 0.152: v41.33,18.46 40.48,19.3 v39.45,19.3 | v53.14,17.7 53.14,17.22 52.42,16.51 47.73,16.51 v47.19,17.04
N$17
  Top 0.254: D4.A 35.91,16.38 37.21,16.38 37.49,16.1 U4.10
NRST  (via drill 0.2 pad 0.6, 0.3 pad 0.7)
  Top 0.152: U1.10 1.53,32 v1.4,32.13 | v16.84,31.06 16.33,30.55 v16.33,28.47 | v20.4,26.95 20.68,27.23 30.63,27.23 v31,26.86 | v31,21.16 31,12.22 C5.1 | X2.4 50.02,29.32 49.31,28.61 v47.33,28.61
  Top 0.305: S1.3 S1.4 C5.1 31,12.22
  Bottom 0.152: v1.4,32.13 2.64,32.13 2.77,32.26 3.58,32.26 5.09,30.75 16.53,30.75 v16.84,31.06 | v20.4,26.95 20.4,27.84 19.76,28.47 v16.33,28.47 | v47.33,28.61 45.92,27.2 35.66,27.2 35.33,26.88 v31,26.88 v31,26.86 v31,21.16
PA0  (via drill 0.2 pad 0.6, 0.3 pad 0.7)
  Top 0.152: U1.3 1.98,35.15 v1.17,34.34 | v29.77,35.38 29.77,34.92 29.95,34.75 34.87,34.75 JP1.5
  Bottom 0.152: v1.17,34.34 1.75,34.92 3.45,34.92 3.86,34.52 3.86,33.77 5.64,31.98 15.44,31.98 18.51,35.05 29.44,35.05 v29.77,35.38
PA1  (via drill 0.2 pad 0.6, 0.3 pad 0.7)
  Top 0.152: U1.2 1.49,35.6 v1.17,35.28 | v28.96,35.76 28.96,35.18 29.69,34.44 32.64,34.44 JP1.7
  Bottom 0.152: v1.17,35.28 3.53,35.28 4.16,34.65 4.16,33.9 5.78,32.28 15.25,32.28 18.33,35.36 28.55,35.36 v28.96,35.76
PA2  (via drill 0.2 pad 0.6, 0.3 pad 0.7)
  Top 0.152: U1.1 1.26,36.08 v1.12,36.22 | v28.17,36.2 28.17,35.51 29.54,34.14 30.36,34.14 31.23,33.27 JP1.9
  Bottom 0.152: v1.12,36.22 1.75,35.58 3.67,35.58 4.46,34.78 4.46,34.03 5.91,32.59 15.12,32.59 18.19,35.66 27.64,35.66 v28.17,36.2
PB2  (via drill 0.3 pad 0.7)
  Top 0.152: U1.48 8.15,36.33 8.32,36.5 11.35,36.5 11.96,37.11 21.85,37.11 v22.35,36.6 | JP1.6 v35.08,32
  Bottom 0.152: v22.35,36.6 23.01,37.26 29.32,37.26 31.6,34.98 34.44,34.98 35.08,34.34 v35.08,32
PB3  (via drill 0.3 pad 0.7)
  Top 0.152: U1.21 4.1,27.92 5.64,26.37 17.29,26.37 18.45,25.21 v18.45,25.05
  Bottom 0.152: JP1.8 32.18,29.1 25.25,29.1 20.94,24.8 19.35,24.8 19.1,25.05 v18.45,25.05
PB4  (via drill 0.3 pad 0.7)
  Top 0.152: U1.20 3.65,27.93 5.51,26.07 16.71,26.07 17.58,25.2 v17.6,25.2
  Bottom 0.152: JP1.10 29.95,29.41 25.09,29.41 20.77,25.08 19.55,25.08 18.95,25.68 18.08,25.68 v17.6,25.2
PB5  (via drill 0.3 pad 0.7)
  Top 0.152: U1.19 3.2,27.94 5.38,25.76 16.16,25.76 16.71,25.21 v16.71,25.2
  Bottom 0.152: JP1.12 28.68,30.73 27.66,29.71 24.94,29.71 20.59,25.36 19.75,25.36 19.12,25.98 17.49,25.98 v16.71,25.2
PB6  (via drill 0.3 pad 0.7)
  Top 0.152: U1.39 9.43,32.45 9.72,32.15 9.72,31.4 10.25,30.88 v10.25,29.14 | v22.49,29.13 24.59,29.13 JP1.14
  Bottom 0.152: v10.25,29.14 10.61,29.5 16.21,29.5 16.83,28.88 19.79,28.88 20.04,29.13 v22.49,29.13
PB7  (via drill 0.3 pad 0.7)
  Top 0.152: U1.18 2.75,27.95 5.27,25.44 15.1,25.44 15.35,25.19 v15.85,25.19
  Bottom 0.152: JP1.16 23.65,28.88 20.4,25.63 19.95,25.63 19.3,26.29 16.95,26.29 v15.85,25.19
PB8  (via drill 0.2 pad 0.6)
  Top 0.152: U1.14 2.97,30.2 v3.12,30.36
  Bottom 0.152: v3.12,30.36 4.07,30.36 4.62,29.81 16.37,29.81 16.99,29.19 19.57,29.19 JP1.18
PB9  (via drill 0.2 pad 0.6)
  Top 0.152: U1.11 3,31.55 v3.1,31.65
  Bottom 0.152: v3.1,31.65 3.73,31.65 4.95,30.43 18.27,30.43 JP1.20
PB10
  Top 0.152: U1.47 11.49,36.08 12.39,35.18 13.07,35.18 C9.1
PB11
  Top 0.152: U1.46 9.03,35.6 9.18,35.75 11.36,35.75 12.72,34.38 12.86,34.38 C10.1
PC0  (via drill 0.2 pad 0.6, 0.3 pad 0.7)
  Top 0.152: U1.12 1.74,31.1 v1.55,31.29 | v17.35,29.8 17.7,29.44 19.18,29.44 19.84,30.1 19.84,31.29 20.55,32 v24.89,32
  Bottom 0.152: v1.55,31.29 1.8,31.04 3.88,31.04 4.82,30.11 16.57,30.11 16.89,29.8 v17.35,29.8 | JP1.13 24.92,32 v24.89,32
PC1  (via drill 0.2 pad 0.6)
  Top 0.152: U1.9 2.66,32.45 3,32.79 v3,32.89
  Bottom 0.152: v3,32.89 3.1,32.79 3.5,32.79 5.22,31.07 15.88,31.07 16.62,31.81 22.19,31.81 JP1.15
PC2  (via drill 0.2 pad 0.6)
  Top 0.152: U1.8 1.62,32.9 v1.55,32.97
  Bottom 0.152: v1.55,32.97 2.09,32.97 2.59,33.48 3.27,33.48 5.37,31.37 15.74,31.37 16.48,32.12 19.95,32.12 JP1.17
PC3  (via drill 0.2 pad 0.6)
  Top 0.152: U1.7 2.59,33.35 3.27,34.03 v3.27,34.11
  Bottom 0.152: v3.27,34.11 3.27,33.91 5.51,31.68 15.61,31.68 16.35,32.42 17.72,32.42 JP1.19
PC5
  Top 0.152: U1.45 9.01,35.15 9.29,35.43 11.13,35.43 12.55,34.01 12.55,32.73 12.72,32.56 12.9,32.56 C8.1
PC10
  Top 0.152: U1.22 4.55,27.89 5.77,26.67 18.05,26.67 20.7,24.03 23.32,24.03 24.13,23.22 R8.1
PC11
  Top 0.152: U1.23 5,27.88 5.91,26.98 18.19,26.98 20.84,24.33 23.45,24.33 24.28,23.5 24.9,23.5 26.11,22.29 R9.1
PC12
  Top 0.152: U1.24 5.45,27.88 6.05,27.28 18.32,27.28 20.97,24.64 23.59,24.64 24.35,23.87 26.61,23.87 R10.2
PD0  (via drill 0.3 pad 0.7)
  Top 0.152: U1.33 8.98,29.75 9.4,29.33 v9.4,28.63 | S2.4 39.09,11.12 37.95,12.27 v34.92,12.27
  Top 0.305: C6.1 41.42,3.1 R5.2 41.27,2.85 S2.3 S2.4
  Bottom 0.152: v9.4,28.63 10.03,27.99 11.32,27.99 12,27.3 12,24.07 13.3,22.77 16.81,22.77 22.17,17.4 32.48,17.4 34.92,14.96 v34.92,12.27
SD_CD  (via drill 0.3 pad 0.7)
  Top 0.152: U1.51 6.85,36.12 6.85,36.33 7.05,36.52 7.87,36.52 8.2,36.85 10.69,36.85 v11.1,37.26 | v11.86,33.63 11.81,33.58 11.81,32.98 11.25,32.41 11.25,32.07 v14.69,28.63 | X3.MP2 42.94,14.41 42.62,14.73 v42.62,15.5
  Bottom 0.152: v11.1,37.26 11.1,35.65 11.86,34.89 v11.86,33.63 | v14.69,28.63 14.69,28.58 13.52,27.41 13.52,24.74 13.98,24.29 17.5,24.29 22.86,18.92 36.42,18.92 37.77,20.27 41.35,20.27 42.62,19 v42.62,15.5
SD_CLK  (via drill 0.2 pad 0.6, 0.3 pad 0.7)
  Top 0.152: v4.21,36.71 4.41,36.51 5.27,36.51 5.45,36.33 U1.54 | v9.42,33.63 9.42,32.93 10.04,32.31 10.04,31.53 11.14,30.43 v11.14,28.63 | v37.54,13.46 36.84,14.16 U4.9 | U4.3 40.11,20.96 40.11,19.1 38.97,17.97 38.97,17.3 38.39,16.72 37.67,16.72 37.29,17.1 v36.83,17.1
  Bottom 0.152: v4.21,36.71 6.92,33.99 9.07,33.99 v9.42,33.64 v9.42,33.63 | v11.14,28.63 12.31,27.46 12.31,24.2 13.44,23.07 16.94,23.07 22.31,17.71 36.22,17.71 v36.83,17.1 36.83,14.17 v37.54,13.46
SD_CS  (via drill 0.2 pad 0.6, 0.3 pad 0.7)
  Top 0.152: U1.50 7.25,35.77 v7.82,35.2 | v11.24,34.28 11.24,32.84 10.95,32.54 10.95,31.93 13.8,29.08 v13.8,28.63 | U4.7 37.49,19.1 v37.34,18.95
  Bottom 0.152: v7.82,35.2 v7.83,35.2 10.78,35.2 11.24,34.73 v11.24,34.28 | v13.8,28.63 13.22,28.04 13.22,24.61 13.84,23.98 17.36,23.98 22.73,18.62 37.01,18.62 v37.34,18.95
SD_DI  (via drill 0.2 pad 0.6, 0.3 pad 0.7)
  Top 0.152: v6.53,36.76 6.4,36.63 6.4,36.12 U1.52 | v10.64,33.65 10.64,31.8 12.91,29.53 v12.91,28.63 | v38.18,18.64 38.79,19.26 U4.5
  Bottom 0.152: v6.53,36.76 6.53,35.28 7.25,34.57 8.82,34.57 9.15,34.9 10.34,34.9 10.64,34.59 v10.64,33.65 | v12.91,28.63 12.91,24.48 13.71,23.68 17.21,23.68 22.58,18.31 37.79,18.31 38.13,18.64 v38.18,18.64
SD_DO  (via drill 0.2 pad 0.6, 0.3 pad 0.7)
  Top 0.152: v5.77,36.76 5.85,36.68 5.85,36.12 U1.53 | v10.03,34.31 10.03,32.77 10.34,32.47 10.34,31.66 12.02,29.98 v12.02,28.63 | v40.16,18.26 41.02,17.41 41.46,17.41 42.38,16.49 45.77,16.49 46.84,15.42 v47.57,15.42 | X3.P7 v53.17,13.31 v53.16,13.31
  Bottom 0.152: v5.77,36.76 5.77,35.61 7.08,34.29 10.01,34.29 v10.03,34.31 | v12.02,28.63 12.02,28.6 12.61,28.01 12.61,24.34 13.57,23.38 17.08,23.38 22.44,18.01 38.44,18.01 39.13,18.7 39.73,18.7 v40.16,18.26 | v53.16,13.31 52.45,14.02 52.45,15.43 51.97,15.9 48.06,15.9 v47.57,15.42
SD_GND  (via drill 0.8 pad 1.2)
  Top 0.508: X3.P6 52.59,14.41 52.09,13.92 v52.09,7.42
SWCLK  (via drill 0.3 pad 0.7)
  Top 0.152: U1.26 6.35,28.09 6.55,27.89 33.98,27.89 v34.31,28.22
  Bottom 0.152: X2.1 46.21,28.4 45.7,27.89 35.61,27.89 35.28,28.22 v34.31,28.22
SWDIO  (via drill 0.3 pad 0.7)
  Top 0.152: U1.25 5.9,27.88 6.2,27.58 34.82,27.58 v34.87,27.53
  Bottom 0.152: v34.87,27.53 45.8,27.53 46.61,28.35 46.61,29.64 47.61,30.64 X2.3
VCC  (via drill 0.3 pad 0.7)
  Top 0.305: v16.15,1.27 13.73,1.27 TP2.TP 12.66,3.66 12.66,6.41 | U2.1 17.95,6.59 v17.93,6.58 17.97,6.54 R2.2 | L1.1 11.31,7.75 12.66,6.41 | 12.66,6.41 C1.1 | U2.8 13.55,7.3 12.66,6.41
  Top 0.813: D1.A 5.33,8.36 | 5.33,8.36 6.45,9.48 | 5.33,8.36 7.57,8.36 8.18,7.75
  Top 1.27: X1.1 5.45,13.24 6.45,12.24 6.45,9.48 8.18,7.75 L1.1
  Bottom 0.305: v16.15,1.27 17.93,3.05 v17.93,6.58
  pour Top (isolate 0.15, no thermals): 14.17,8.56 8.18,8.56 8.18,0.51 14.17,0.51
  pour Top (isolate 0.15, no thermals): 17.32,8.56 18.57,8.56 18.57,7.14 20.75,7.14 20.75,5.92 17.32,5.92
VDD
  Top 0.305: SJ1.3 13.46,20.19 12.5,19.23 12.5,18.57 C4.1 12.14,18.01 13.15,17 U3.6

### Text on the board
tNames: PORTC | PORTA | 3 | 2 | 1 | 0 | 2 | 1 | 0 | GND | 3V3 | GFB_MCU_Testboard / Design by Hannes Heilmann / Version 0.1 - 26.07.2022 | 9 | 8 | 7 | 6 | 5 | 4 | 3 | 2 | SWD | U1 | PORTB | GND | 3V3 | REF | ON | OFF | 3V3 | + | VCC | GND | RST | BTN